# EAGLE design expansion-w-power (EAGLE 7.5.0)
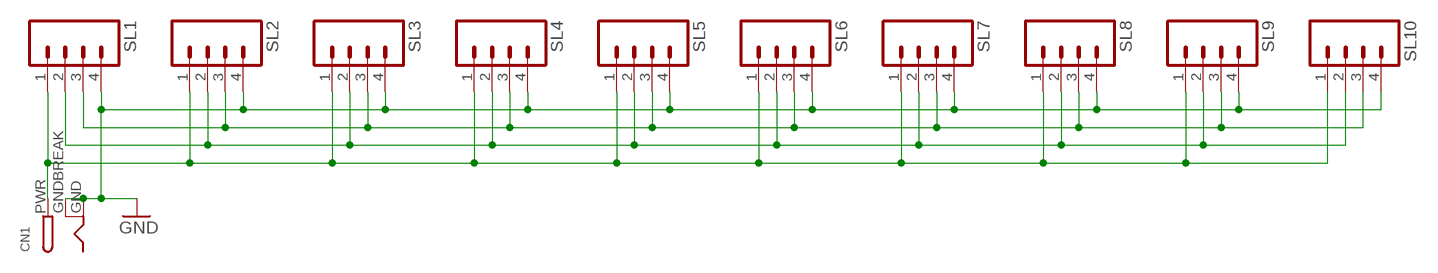
[diagram p0: schematic, sheet 1]

## Parts
CN1  DCBARRELPTH  [DCJACK_2MM_PTH]
SL1  M04  [04P]
SL2  M04  [04P]
SL3  M04  [04P]
SL4  M04  [04P]
SL5  M04  [04P]
SL6  M04  [04P]
SL7  M04  [04P]
SL8  M04  [04P]
SL9  M04  [04P]
SL10  M04  [04P]

## Nets
GND: CN1.GND CN1.GNDBREAK SL1.4 SL2.4 SL3.4 SL4.4 SL5.4 SL6.4 SL7.4 SL8.4 SL9.4 SL10.4
N$2: SL1.3 SL2.3 SL3.3 SL4.3 SL5.3 SL6.3 SL7.3 SL8.3 SL9.3 SL10.3
N$3: SL1.2 SL2.2 SL3.2 SL4.2 SL5.2 SL6.2 SL7.2 SL8.2 SL9.2 SL10.2
N$4: CN1.PWR SL1.1 SL2.1 SL3.1 SL4.1 SL5.1 SL6.1 SL7.1 SL8.1 SL9.1 SL10.1

## Library data of the parts
CN1 = adafruit:DCBARREL: 2.0mm DC Barrel Jack DCJACK_2MM_PTH - Through Hole Jack (4UConnector: 05537)
SL1-SL10 = con-amp-quick:M04: AMP QUICK CONNECTOR; OC_FARNELL: unknown; OC_NEWARK: unknown

## Board
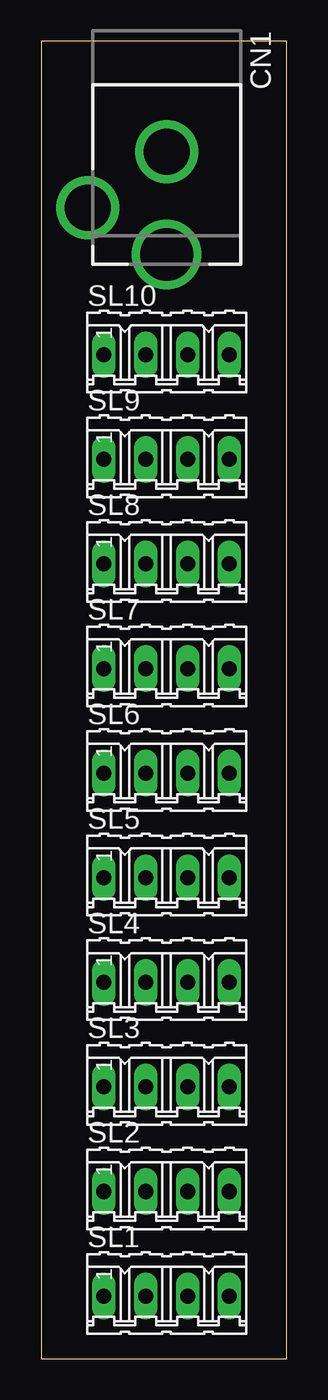
[diagram p1: board, top side]
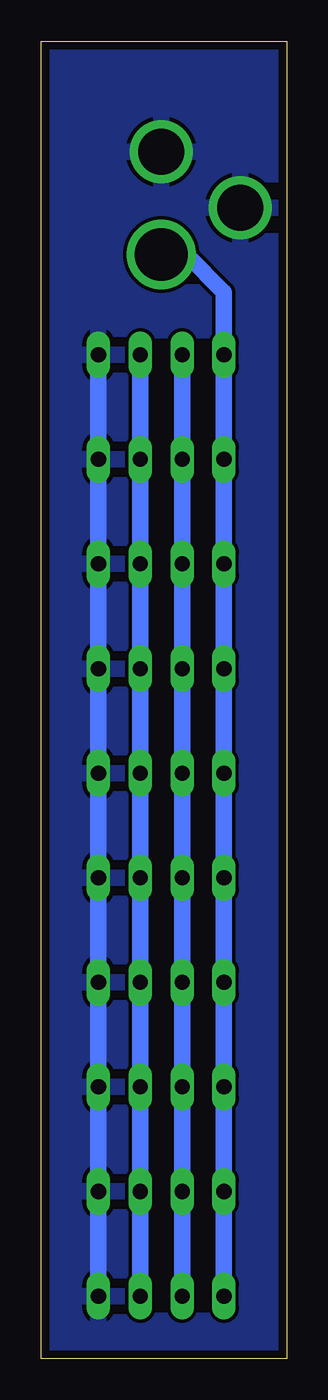
[diagram p2: board, bottom side, seen from below]

Size 14.91 x 80 mm. Coordinates in mm from the lower left corner, seen from the top.
Outline: 0,0 14.91,0 14.91,80 0,80 0,0
Copper layers (1*16): Top 0.035mm / dielectric 1.5mm / Bottom 0.035mm
Design rules "default *": minimum track width 10mil, minimum drill 24mil, track to track 8mil, track to pad 12mil, pad to pad 12mil, via to via 12mil, smd to smd 8mil, copper to edge 20mil, drill to drill 8mil, minimum pad ring 10mil, minimum via ring 8mil, stop-mask expansion 4mil, vias tented up to drill 0mil, thermal gap 10mil

### Footprints (pad centres in the part's own frame; a part is rotated, then mirrored left to right if it is on the bottom)
DCJACK_2MM_PTH = drill 2.8: GND 0,7.35; GNDBREAK 4.8,10.75 | drill 3.2: PWR 0,13.6
04P = drill 0.914 long: 1 -3.81,0; 2 -1.27,0; 3 1.27,0; 4 3.81,0

### Placement (x,y rotation side)
CN1  7.62,80.64 180 top
SL1  7.62,3.81 0 top
SL2  7.62,10.16 0 top
SL3  7.62,16.51 0 top
SL4  7.62,22.86 0 top
SL5  7.62,29.21 0 top
SL6  7.62,35.56 0 top
SL7  7.62,41.91 0 top
SL8  7.62,48.26 0 top
SL9  7.62,54.61 0 top
SL10  7.62,60.96 0 top

### Tracks (layer width: path | path; a pad name or v marks a point on that pad's centre or on a via)
GND
  Bottom 1.016: SL1.4 SL2.4 SL3.4 SL4.4 SL5.4 SL6.4 SL7.4 SL8.4 SL9.4 SL10.4
  pour Bottom: 0,80.01 15.24,80.01 15.24,0 0,0
N$2
  Bottom 1.016: SL10.3 SL9.3 SL8.3 SL7.3 SL6.3 SL5.3 SL4.3 SL3.3 SL2.3 SL1.3
N$3
  Bottom 1.016: SL1.2 SL2.2 SL3.2 SL4.2 SL5.2 | 6.35,30.48 SL5.2 | SL5.2 SL6.2 SL7.2 SL8.2 SL9.2 SL10.2
N$4
  Bottom 1.016: SL1.1 SL2.1 SL3.1 SL4.1 SL5.1 SL6.1 SL7.1 SL8.1 SL9.1 SL10.1 3.81,64.77 6.08,67.05 CN1.PWR